# EAGLE design hat (EAGLE 9.6.2)
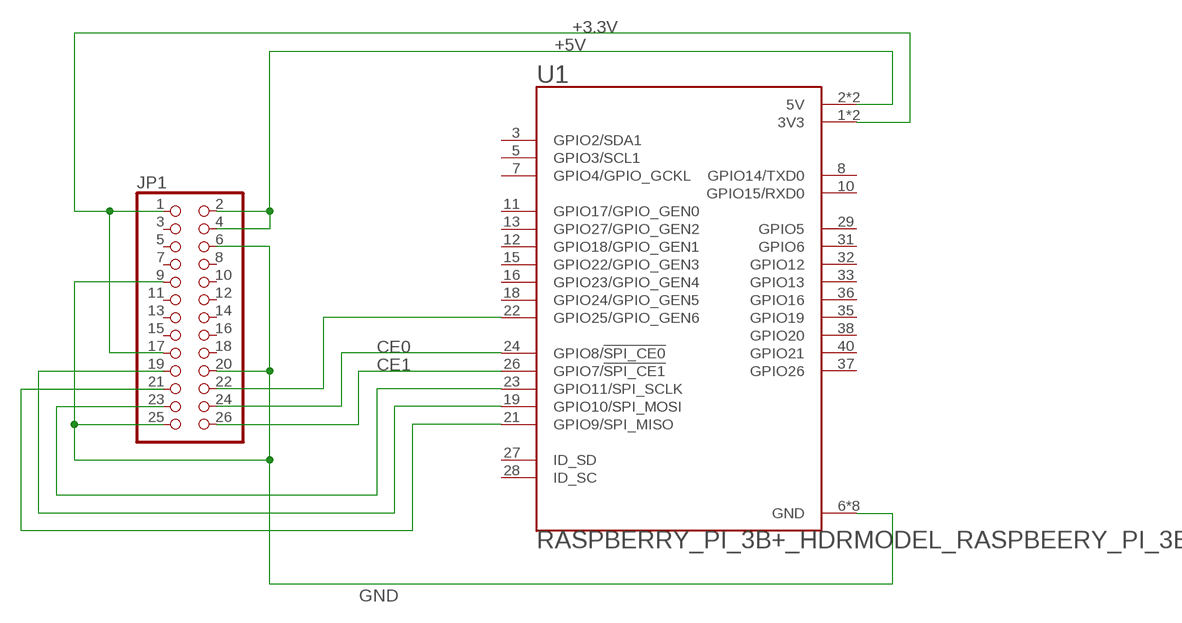
[diagram p0: schematic, sheet 1]

## Parts
JP1  PINHD-2X13  [2X13]
U1  RASPBERRY_PI_3B+_HDRMODEL_RASPBEERY_PI_3B_HDR  [MODULE_RASPBERRY_PI_3B+_HDR]

## Nets
+3.3V: JP1.1 JP1.17 U1.1(3V3) U1.17(3V3)
+5V: JP1.2 JP1.4 U1.2(5V) U1.4(5V)
CE0: JP1.24 U1.24(GPIO8/!SPI_CE0!)
CE1: JP1.26 U1.26(GPIO7/!SPI_CE1!)
GND: JP1.6 JP1.9 JP1.20 JP1.25 U1.6(GND) U1.9(GND) U1.14(GND) U1.20(GND) U1.25(GND) U1.30(GND) U1.34(GND) U1.39(GND)
N$1: JP1.23 U1.23(GPIO11/SPI_SCLK)
N$2: JP1.19 U1.19(GPIO10/SPI_MOSI)
N$3: JP1.21 U1.21(GPIO9/SPI_MISO)
N$4: JP1.22 U1.22(GPIO25/GPIO_GEN6)
Unconnected: JP1.3 JP1.5 JP1.7 JP1.8 JP1.10 JP1.11 JP1.12 JP1.13 JP1.14 JP1.15 JP1.16 JP1.18 U1.3(GPIO2/SDA1) U1.5(GPIO3/SCL1) U1.7(GPIO4/GPIO_GCKL) U1.8(GPIO14/TXD0) U1.10(GPIO15/RXD0) U1.11(GPIO17/GPIO_GEN0) U1.12(GPIO18/GPIO_GEN1) U1.13(GPIO27/GPIO_GEN2) U1.15(GPIO22/GPIO_GEN3) U1.16(GPIO23/GPIO_GEN4) U1.18(GPIO24/GPIO_GEN5) U1.27(ID_SD) U1.28(ID_SC) U1.29(GPIO5) U1.31(GPIO6) U1.32(GPIO12) U1.33(GPIO13) U1.35(GPIO19) U1.36(GPIO16) U1.37(GPIO26) U1.38(GPIO20) U1.40(GPIO21)

## Library data of the parts
JP1 = pinhead:PINHD-2X13: PIN HEADER
U1 = raspberry_pi_3b:RASPBERRY_PI_3B+_HDR: Check availability <https://pricing.snapeda.com/parts/RASPBERRY%20PI%203%20MODEL%20B%2B/Raspberry%20Pi/view-part?ref=eda>

## Board
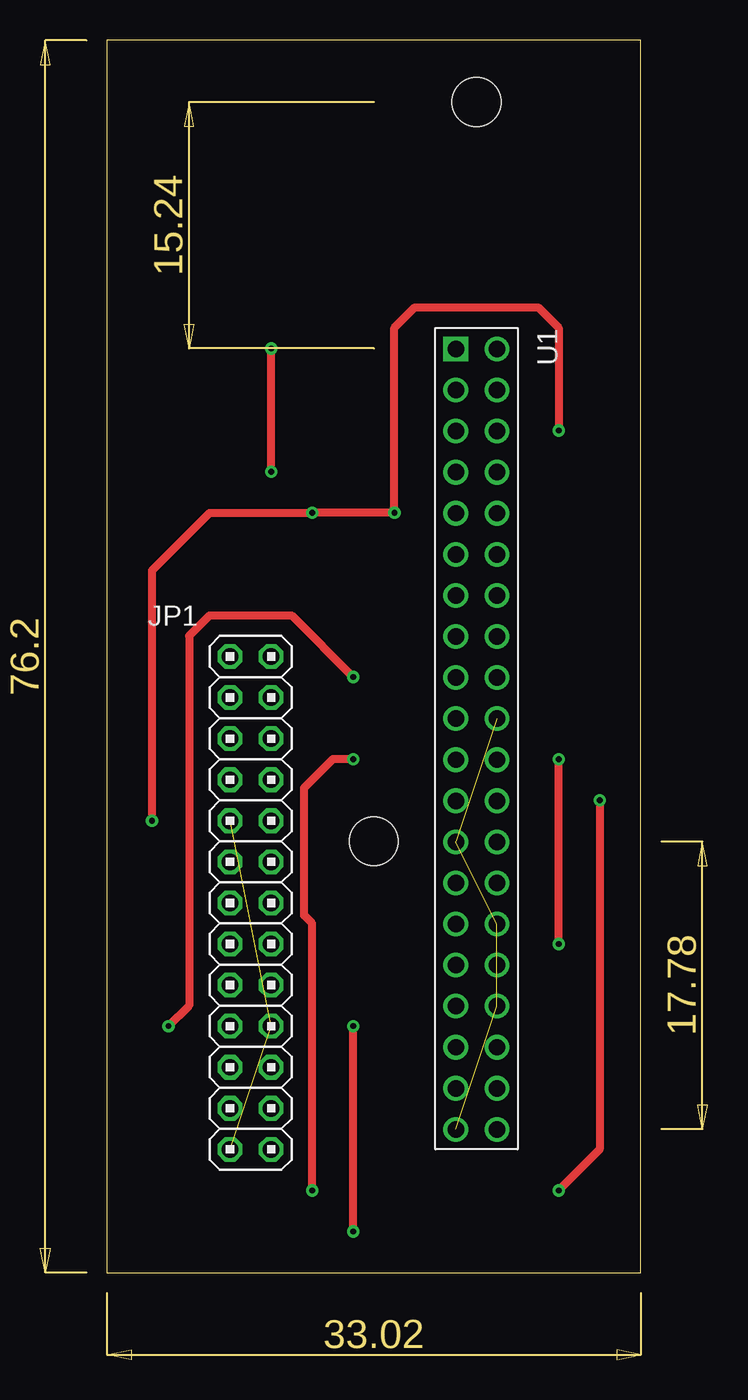
[diagram p1: board, top side]
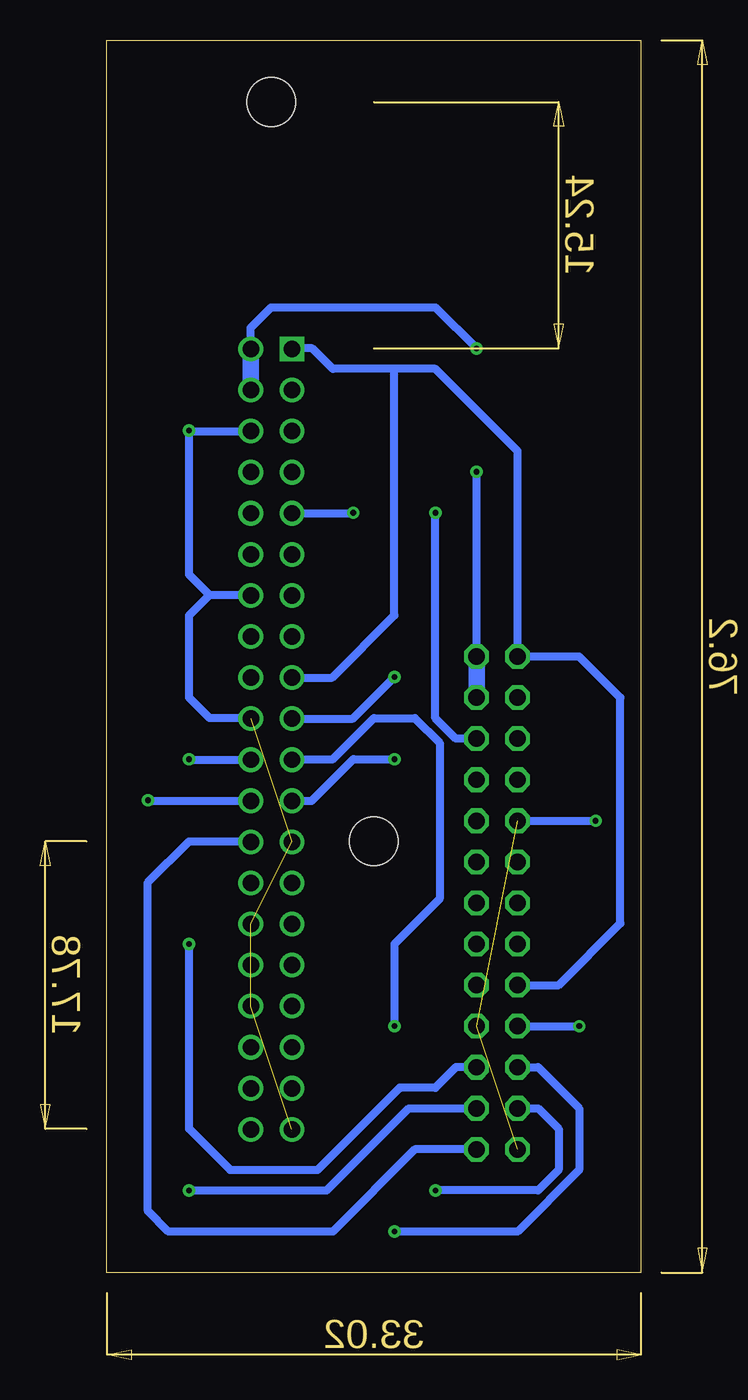
[diagram p2: board, bottom side, seen from below]

Size 33.02 x 76.2 mm. Coordinates in mm from the lower left corner, seen from the top.
Outline: 0,0 33.02,0 33.02,76.2 0,76.2 0,0
Copper layers (1*16): Top 0.035mm / dielectric 1.5mm / Bottom 0.035mm
Design rules "default": minimum track width 6mil, minimum drill 0.35mm, track to track 6mil, track to pad 6mil, pad to pad 6mil, via to via 6mil, smd to smd 6mil, copper to edge 40mil, drill to drill 6mil, minimum pad ring 10mil, minimum via ring 8mil, stop-mask expansion 4mil, vias tented up to drill 0mil, thermal gap 10mil
Holes 3 mm at 16.51,26.67 22.86,72.39

### Footprints (pad centres in the part's own frame; a part is rotated, then mirrored left to right if it is on the bottom)
2X13 = drill 1.016 octagon: 1 -15.24,-1.27; 2 -15.24,1.27; 3 -12.7,-1.27; 4 -12.7,1.27; 5 -10.16,-1.27; 6 -10.16,1.27; 7 -7.62,-1.27; 8 -7.62,1.27; 9 -5.08,-1.27; 10 -5.08,1.27; 11 -2.54,-1.27; 12 -2.54,1.27; 13 0,-1.27; 14 0,1.27; 15 2.54,-1.27; 16 2.54,1.27; 17 5.08,-1.27; 18 5.08,1.27; 19 7.62,-1.27; 20 7.62,1.27; 21 10.16,-1.27; 22 10.16,1.27; 23 12.7,-1.27; 24 12.7,1.27; 25 15.24,-1.27; 26 15.24,1.27
MODULE_RASPBERRY_PI_3B+_HDR = drill 1.016 square: 1 0.033,-0.011 | drill 1.016: 2 0.033,2.529; 3 2.573,-0.011; 4 2.573,2.529; 5 5.113,-0.011; 6 5.113,2.529; 7 7.653,-0.011; 8 7.653,2.529; 9 10.193,-0.011; 10 10.193,2.529; 11 12.733,-0.011; 12 12.733,2.529; 13 15.273,-0.011; 14 15.273,2.529; 15 17.813,-0.011; 16 17.813,2.529; 17 20.353,-0.011; 18 20.353,2.529; 19 22.893,-0.011; 20 22.893,2.529; 21 25.433,-0.011; 22 25.433,2.529; 23 27.973,-0.011; 24 27.973,2.529; 25 30.513,-0.011; 26 30.513,2.529; 27 33.053,-0.011; 28 33.053,2.529; 29 35.593,-0.011; 30 35.593,2.529; 31 38.133,-0.011; 32 38.133,2.529; 33 40.673,-0.011; 34 40.673,2.529; 35 43.213,-0.011; 36 43.213,2.529; 37 45.753,-0.011; 38 45.753,2.529; 39 48.293,-0.011; 40 48.293,2.529

### Placement (x,y rotation side)
JP1  8.89,22.86 270 top
U1  21.59,57.15 270 top

### Tracks (layer width: path | path; a pad name or v marks a point on that pad's centre or on a via)
+3.3V
  Bottom 0.508: 15.24,55.88 12.7,55.88 7.62,50.8 JP1.1 3.81,38.1 1.27,35.56 1.27,21.59 5.08,17.78 JP1.17 | 15.24,55.88 19.05,55.88 20.32,57.15 21.55,57.15 U1.1 | U1.17 19.08,36.8 15.24,40.64 15.24,55.88
+5V  (via drill 0.35)
  Top 0.508: v10.16,49.53 v10.16,57.15
  Bottom 0.508: JP1.2 v10.16,49.53 | v10.16,57.15 12.7,59.69 22.86,59.69 24.13,58.42 24.12,58.41 U1.2
  Bottom 1.016: JP1.4 JP1.2 | U1.4 U1.2
CE0  (via drill 0.35)
  Top 0.508: v30.48,29.21 30.48,7.62 v27.94,5.08
  Bottom 0.508: v30.48,29.21 30.45,29.18 U1.24 | JP1.24 14.35,10.16 19.43,5.08 v27.94,5.08
CE1
  Bottom 0.508: U1.26 24.15,26.67 27.94,26.67 30.48,24.13 30.48,3.81 29.21,2.54 19.05,2.54 13.97,7.62 JP1.26
GND  (via drill 0.35)  (6 unrouted)
  Top 0.508: v2.79,27.94 2.79,43.43 6.35,46.99 v12.7,46.99 v17.78,46.99 17.78,58.42 19.05,59.69 26.67,59.69 27.94,58.42 v27.94,52.07
  Bottom 0.508: JP1.6 11.43,33.02 12.7,34.29 v12.7,46.99 | U1.9 17.81,46.96 v17.78,46.99 | JP1.9 v2.79,27.94 | U1.6 27.91,52.04 v27.94,52.07 27.94,43.16 26.66,41.88 U1.14 24.15,41.91 26.67,41.91 27.94,40.64 27.94,35.56 26.67,34.29 24.15,34.29 U1.20
N$1  (via drill 0.35)
  Top 0.508: v15.24,31.75 13.97,31.75 12.19,29.97 12.19,22.1 12.7,21.59 v12.7,5.08
  Bottom 0.508: JP1.23 6.35,10.16 5.08,8.89 5.08,6.35 6.35,5.08 v12.7,5.08 | 21.56,29.18 U1.23 20.35,29.18 17.78,31.75 v15.24,31.75
N$2  (via drill 0.35)
  Top 0.508: v15.24,36.83 11.43,40.64 6.35,40.64 5.08,39.37 5.08,16.51 v3.81,15.24
  Bottom 0.508: U1.19 17.81,34.26 v15.24,36.83 | JP1.19 v3.81,15.24
N$3  (via drill 0.35)
  Top 0.508: v15.24,2.54 v15.24,15.24
  Bottom 0.508: JP1.21 6.35,12.7 3.81,10.16 3.81,6.35 7.62,2.54 v15.24,2.54 | U1.21 19.08,31.72 16.51,34.29 13.97,34.29 12.45,32.77 12.45,23.11 15.24,20.32 v15.24,15.24
N$4  (via drill 0.35)
  Top 0.508: v27.94,20.32 v27.94,31.75
  Bottom 0.508: v27.94,20.32 27.94,8.89 25.4,6.35 19.98,6.35 14.88,11.46 14.85,11.43 12.7,11.43 11.43,12.7 JP1.22 | v27.94,31.75 27.91,31.72 U1.22